# Altium schematic sheet ATMEGA328.SchDoc: ATMEGA328
size A4; CompanyName: github.com/aKaReZa75; Revision: 1.0; SheetNumber: 1; SheetTotal: 1; Project_Name: Design Template
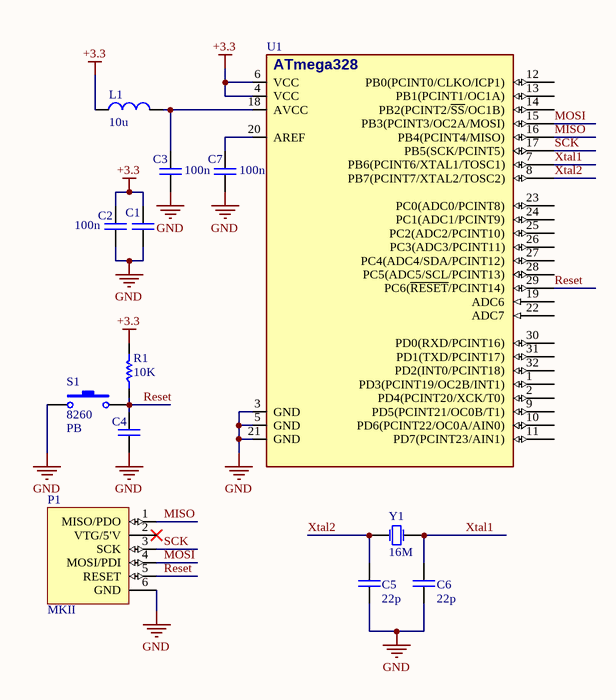
[diagram p0: ATMEGA328.SchDoc]

## Parts
C1  100n  [CAP 0805/2012]
C2  100n  [CAP 0805/2012]  (value not drawn)
C3  100n  [CAP 0805/2012]
C4  100n  [CAP 0805/2012]  (value not drawn)
C5  22p  [CAP 0805/2012]
C6  22p  [CAP 0805/2012]
C7  100n  [CAP 0805/2012]
L1  10u  [IND0805]
P1  Type: MKII  [IDC_2X3]  (hidden comment: 3x2)
R1  10K  [RES 0805 (2012X06L)]
S1  Inflow: 8260  [SW_PB_SMD_2PIN_SPST_6X3X2]  (hidden comment: PB)
U1  ATmega328P  [QFG50_48]  (value not drawn)
Y1  16M  [Crystal SMD]

## Nets
+3.3: C1.1 C2.1 L1.1 R1.2 U1.4(VCC) U1.6(VCC)
GND: C1.2 C2.2 C3.2 C4.2 C5.2 C6.2 C7.2 P1.6(GND) S1.1 U1.3(GND) U1.5(GND) U1.21(GND)
MISO: P1.1(MISO/PDO) U1.16(PB4(PCINT4/MISO))
MOSI: P1.4(MOSI/PDI) U1.15(PB3(PCINT3/OC2A/MOSI))
Reset: C4.1 P1.5(RESET) R1.1 S1.2 U1.29(PC6(~{RESET}/PCINT14))
SCK: P1.3(SCK) U1.17(PB5(SCK/PCINT5))
Xtal1: C6.1 U1.7(PB6(PCINT6/XTAL1/TOSC1)) Y1.2(OSC2)
Xtal2: C5.1 U1.8(PB7(PCINT7/XTAL2/TOSC2)) Y1.1(OSC1)
NetC3_1: C3.1 L1.2 U1.18(AVCC)
NetC7_1: C7.1 U1.20(AREF)

Not connected (* = marked no-connect by the designer): P1 2(VTG/5'V)*; U1 1(PD3(PCINT19/OC2B/INT1)) 2(PD4(PCINT20/XCK/T0)) 9(PD5(PCINT21/OC0B/T1)) 10(PD6(PCINT22/OC0A/AIN0)) 11(PD7(PCINT23/AIN1)) 12(PB0(PCINT0/CLKO/ICP1)) 13(PB1(PCINT1/OC1A)) 14(PB2(PCINT2/~{SS}/OC1B)) 19(ADC6) 22(ADC7) 23(PC0(ADC0/PCINT8)) 24(PC1(ADC1/PCINT9)) 25(PC2(ADC2/PCINT10)) 26(PC3(ADC3/PCINT11)) 27(PC4(ADC4/SDA/PCINT12)) 28(PC5(ADC5/SCL/PCINT13)) 30(PD0(RXD/PCINT16)) 31(PD1(TXD/PCINT17)) 32(PD2(INT0/PCINT18))

## Notes on the sheet
- Title:
- Project:
- Drawn by:
- Revision:
- Hossein Bagheri
- Company:
- Sheet
- of
- (in symbol IC_MCU_ATmega328P_SMD) ATmega328

## Library data of the parts
C1-C4 C7 = Cap_Multi_SMD_100nF_0805: Bipolar ceramic capacitor SMD; Inflow: inflow?; Type: MultiLayer; Rating: 50V; Validation: Valid; Package: 0805; Value: 100n
C5 C6 = Cap_Multi_SMD_0805: Bipolar ceramic capacitor SMD; Inflow: inflow?; Type: MultiLayer; Rating: Rating?; Validation: Valid; Package: 0805; Value: 22p
L1 = Ind_SMD_0805: Inductor; Inflow: inflow?; Type: SMD; Rating: Rating?; Validation: Valid; Package: 0805; Value: 10u
P1 = Con_Prog_MKII_ISP: 6 Pin Standard ISP Header For MKII; Rating: Rating?; Validation: NT; Inflow: inflow?; Value: 3x2; Package: Package?
R1 = Res_SMD_0805: Resistor; Inflow: inflow?; Rating: 0.125W; Validation: Valid; Package: 0805; Type: 10%; Value: 10K
S1 = SW_PushButton_2_SMD: SMT Tactile ‎Switch; Rating: 2b; Validation: Valid; Type: Vertical; Package: SMD; Value: PB
U1 = IC_MCU_ATmega328P_SMD: 8-Bit AVR Microcontroller with 32K Bytes of In-System Programmable Flash Memory; Rating: Rating?; Validation: Valid; Inflow: inflow?; Value: ATmega328P; Package: Package?; Type: Type?
Y1 = Other_Elec_Xtal_SMD: Crystal Oscillator; Rating: Rating?; Inflow: inflow?; Validation: Valid; Package: SMD; Type: Quartz; Value: 16M